# EAGLE design a78-simple-epi (EAGLE 7.0.0)
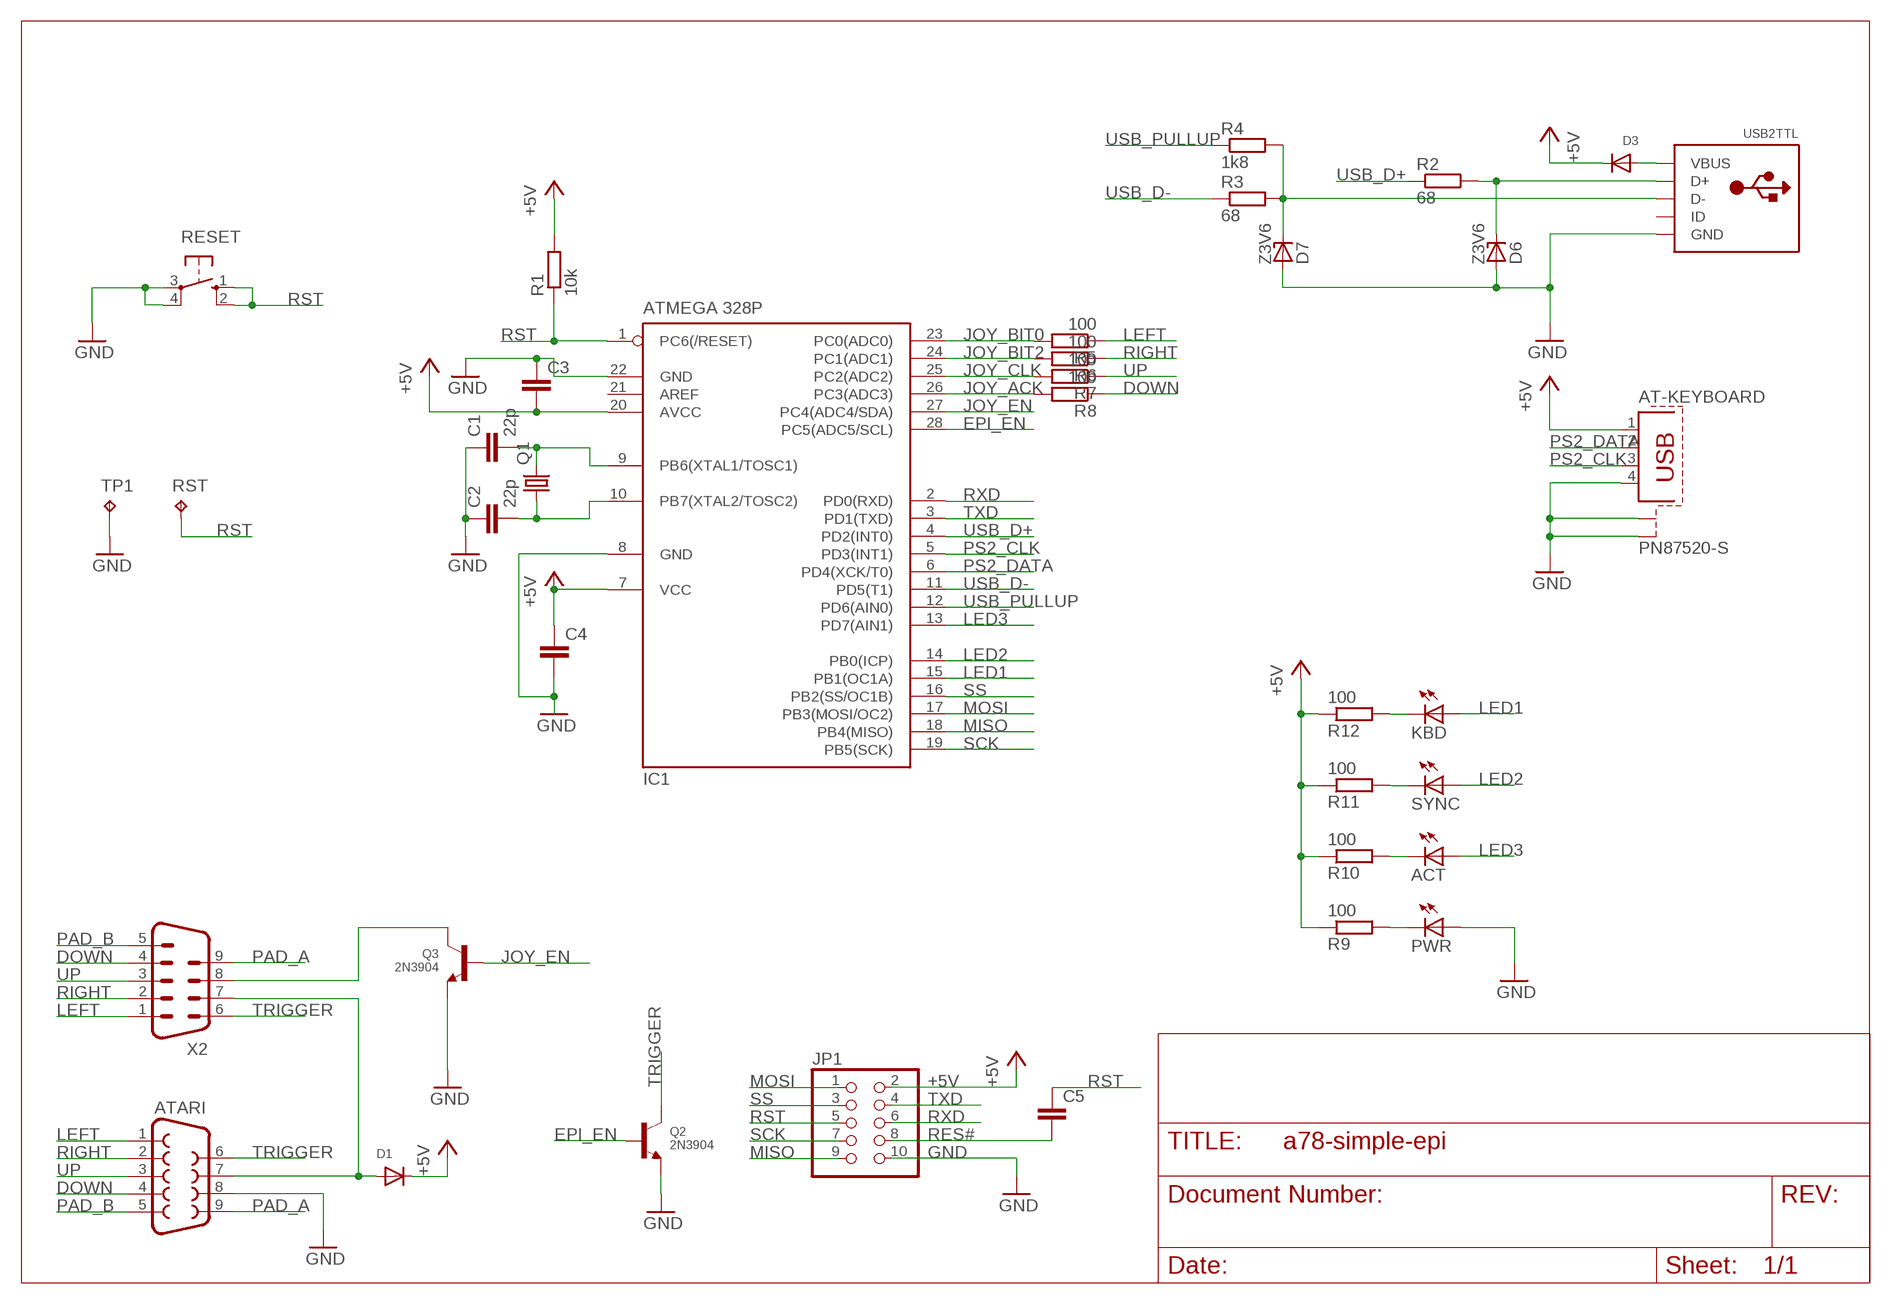
[diagram p0: schematic, sheet 1]

## Parts
ACT  LED3MM  [LED3MM]
AT-KEYBOARD  PN87520-S  [PN87520-S]
ATARI  F09D  [F09D]
C1  22p  C-EUC0603  [C0603]
C2  22p  C-EUC0603  [C0603]
C3  C-EUC0603  [C0603]
C4  C-EUC0603  [C0603]
C5  C-EUC0603  [C0603]
D1  DIODESOD-323F  [SOD-323F]
D3  DIODESOD-323F  [SOD-323F]
D6  Z3V6  ZENER-DIODESOT23  [SOT23]
D7  Z3V6  ZENER-DIODESOT23  [SOT23]
IC1  ATMEGA 328P  MEGA8-P  [DIL28-3]
JP1  PINHD-2X5  [2X05]
KBD  LED3MM  [LED3MM]
PWR  LED3MM  [LED3MM]
Q1  CRYSTALHC49S  [HC49S]
Q2  2N3904  TRANSISTOR_NPN  [SOT23-R]
Q3  2N3904  TRANSISTOR_NPN  [SOT23-R]
R1  10k  R-EU_R0603  [R0603]
R2  68  R-EU_R0603  [R0603]
R3  68  R-EU_R0603  [R0603]
R4  1k8  R-EU_R0603  [R0603]
R5  100  R-EU_R0603  [R0603]
R6  100  R-EU_R0603  [R0603]
R7  100  R-EU_R0603  [R0603]
R8  100  R-EU_R0603  [R0603]
R9  100  R-EU_R0603  [R0603]
R10  100  R-EU_R0603  [R0603]
R11  100  R-EU_R0603  [R0603]
R12  100  R-EU_R0603  [R0603]
RESET  10-XX  [B3F-10XX]
RST  TPB1,27  [B1,27]
SYNC  LED3MM  [LED3MM]
TP1  TPB1,27  [B1,27]
USB2TTL  USBMINIB  [USB-MINIB]
X2  M09D  [M09D]

## Nets
+5V: AT-KEYBOARD.1 C3.2 C4.1 D1.C D3.C IC1.7(VCC) IC1.20(AVCC) JP1.2 R1.2 R9.1 R10.1 R11.1 R12.1
DOWN: ATARI.4 R8.1 X2.4
EPI_EN: IC1.28(PC5(ADC5/SCL)) Q2.1(B)
GND: AT-KEYBOARD.4 AT-KEYBOARD.S1 AT-KEYBOARD.S2 ATARI.8 C1.1 C2.1 C3.1 C4.2 D6.1(A) D7.1(A) IC1.8(GND) IC1.22(GND) JP1.10 PWR.A Q2.2(E) Q3.2(E) RESET.3(P) RESET.4(P1) TP1.TP USB2TTL.GND
JOY_ACK: IC1.26(PC3(ADC3)) R8.2
JOY_BIT0: IC1.23(PC0(ADC0)) R5.2
JOY_BIT2: IC1.24(PC1(ADC1)) R6.2
JOY_CLK: IC1.25(PC2(ADC2)) R7.2
JOY_EN: IC1.27(PC4(ADC4/SDA)) Q3.1(B)
LED1: IC1.15(PB1(OC1A)) KBD.A
LED2: IC1.14(PB0(ICP)) SYNC.A
LED3: ACT.A IC1.13(PD7(AIN1))
LEFT: ATARI.1 R5.1 X2.1
MISO: IC1.18(PB4(MISO)) JP1.9
MOSI: IC1.17(PB3(MOSI/OC2)) JP1.1
N$1: Q3.3(C) X2.8
N$2: PWR.K(C) R9.2
N$3: ACT.K(C) R10.2
N$4: R11.2 SYNC.K(C)
N$5: KBD.K(C) R12.2
N$13: D7.3(C) R3.2 R4.2 USB2TTL.D-
N$14: D3.A USB2TTL.VBUS
N$15: D6.3(C) R2.2 USB2TTL.D+
N$17: ATARI.7 D1.A X2.7
N$19: C1.2 IC1.9(PB6(XTAL1/TOSC1)) Q1.2
N$20: C2.2 IC1.10(PB7(XTAL2/TOSC2)) Q1.1
PAD_A: ATARI.9 X2.9
PAD_B: ATARI.5 X2.5
PS2_CLK: AT-KEYBOARD.3 IC1.5(PD3(INT1))
PS2_DATA: AT-KEYBOARD.2 IC1.6(PD4(XCK/T0))
RES#: C5.2 JP1.8
RIGHT: ATARI.2 R6.1 X2.2
RST: C5.1 IC1.1(PC6(/RESET)) JP1.5 R1.1 RESET.1(S) RESET.2(S1) RST.TP
RXD: IC1.2(PD0(RXD)) JP1.6
SCK: IC1.19(PB5(SCK)) JP1.7
SS: IC1.16(PB2(SS/OC1B)) JP1.3
TRIGGER: ATARI.6 Q2.3(C) X2.6
TXD: IC1.3(PD1(TXD)) JP1.4
UP: ATARI.3 R7.1 X2.3
USB_D+: IC1.4(PD2(INT0)) R2.1
USB_D-: IC1.11(PD5(T1)) R3.1
USB_PULLUP: IC1.12(PD6(AIN0)) R4.1
Unconnected: IC1.21(AREF) USB2TTL.ID

## Library data of the parts
ACT KBD PWR SYNC = adafruit:LED: LED OSRAM: - CHIPLED LG R971, LG N971, LY N971, LG Q971, LY Q971, LO R971, LY R971 LH N974, LH R974 LS Q976, LO Q976, LY Q976 LO Q996 - Hyper CHIPLED LW Q18S LB Q993, LB Q99A, LB R99A - SideLED LS A670, LO A670, LY A670, LG A670, LP A670 LB A673, LV A673, LT A673, LW A673 LH A674 LY A675 LS A676, LA A676, LO A676, LY A676, LW A676 LS A679, LY A679, LG A679 - Hyper Micro SIDELED® LS Y876, LA Y876, LO Y876, LY Y876 LT Y87S - SmartLED LW L88C, LW L88S LB L89C, LB L89S, LG L890 LS L89K, LO L89K, LY L89K LS L896, LA L896, LO L896, LY L896 - TOPLED LS T670, LO T670, LY T670, LG T670, LP T670 LSG T670, LSP T670, LSY T670, LOP T670, LYG T670 LG T671, LOG T671, LSG T671 LB T673, LV T673, LT T673, LW T673 LH T674 LS T676, LA T676, LO T676, LY T676, LB T676, LH T676, LSB T676, LW T676 LB T67C, LV T67C, LT T67C, LS T67K, LO T67K, LY T67K, LW E67C LS E67B, LA E67B, LO E67B, LY E67B, LB E67C, LV E67C, LT E67C LW T67C LS T679, LY T679, LG T679 LS T770, LO T770, LY T770, LG T770, LP T770 LB T773, LV T773, LT T773, LW T773 LH T774 LS E675, LA E675, LY E675, LS T675 LS T776, LA T776, LO T776, LY T776, LB T776 LHGB T686 LT T68C, LB T68C - Hyper Mini TOPLED® LB M676 - Mini TOPLED Santana® LG M470 LS M47K, LO M47K, LY M47K Source: http://www.osram.convergy.de/
AT-KEYBOARD = con-berg:PN87520-S; OC_FARNELL: unknown; OC_NEWARK: unknown
ATARI = con-subd:F09: SUB-D; OC_FARNELL: unknown; OC_NEWARK: unknown
C1-C5 = resistor:C-EU: CAPACITOR, European symbol
D1 D3 = adafruit:DIODE: Diode SMADIODE - SMA Surface Mount Package 20V 1A Schottky Diode Digikey: 641-1014-6-ND DO-1N4148 - Through Hole Small Current Diode SOD-123 20V 1 A (.5mV Vf) Schottky Diode - Digikey: MBRX120TPMSCT-ND SOD-323 10V 570mA (.38mV Vf, 3ns) Schottky Diode - Digikey: ZLLS410CT-ND SOD-523 30V 30mA Schottky Diode (RB751S-40TE61) - Digikey: RB751S-40TE61CT-ND SOT23-R/W - SOT23 Package (R = Solder Paste/Reflow Ovens, W = Hand-Soldering) BAT54Film 40V 300mA - Digikey: 497-7162-1-ND
D6 D7 = diode:ZENER-DIODE: Z-Diode
IC1 = atmel:MEGA8-P: MICROCONTROLLER 8 Kbytes FLASH, 1 kbytes SRAM, 512 bytes EEPROM, USART, 4-channel 10 bit ADC, 2-channel 8 bit ADC Pin compatible with Atmega48, ATMega88, ATMega168 Source: avr.lbr; OC_FARNELL: unknown; OC_NEWARK: unknown
JP1 = pinhead:PINHD-2X5: PIN HEADER
Q1 = adafruit:CRYSTAL: CRYSTAL; OC_FARNELL: 1667008; OC_NEWARK: unknown
Q2 Q3 = microbuilder:TRANSISTOR_NPN: NPN Transistor Transistor (NPN) 500mA 45V - BC817 [Digikey: 568-1631-1-ND] Transistor (NPN) 500mA 45V - BC817,215 [Mouser: 771-BC817-T/R] SOT23-R - SOT23 footprint optimised for use with solder paste and reflow ovens. SOT23-W - SOT23 footprint optimised for hand-soldering (larger pads).
R1-R12 = resistor:R-EU_: RESISTOR, European symbol
RESET = switch-omron:10-XX: OMRON SWITCH; MPN: B3F-1000; OC_FARNELL: 176432; OC_NEWARK: 36M3542
RST TP1 = testpad:TP: Test pad
USB2TTL = adafruit:USB: USB Connectors USBMINIB - Surface Mount Female Mini-B USB Connector 4UConnector: 06564 By microbuilder.eu Thru-hole RA Female Mini-B USB Connector 4UConnector: 18732 By ladyada.net
X2 = con-subd:M09: SUB-D; OC_FARNELL: unknown; OC_NEWARK: unknown

## Board
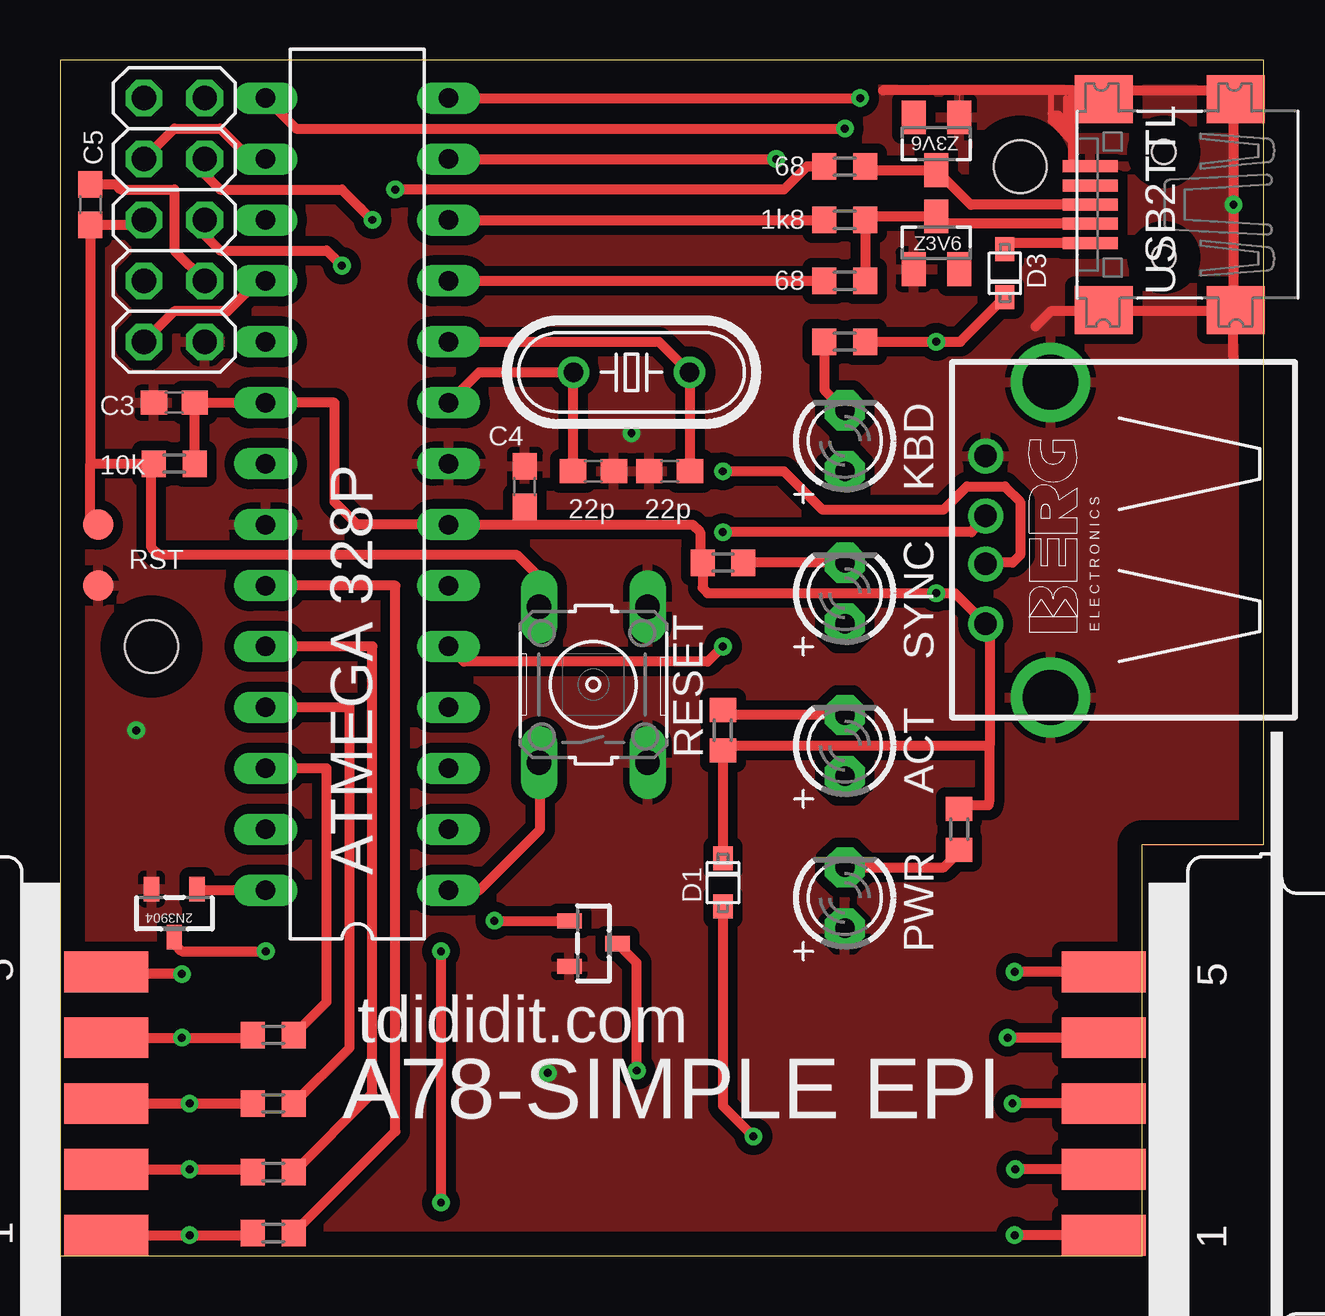
[diagram p1: board, top side]
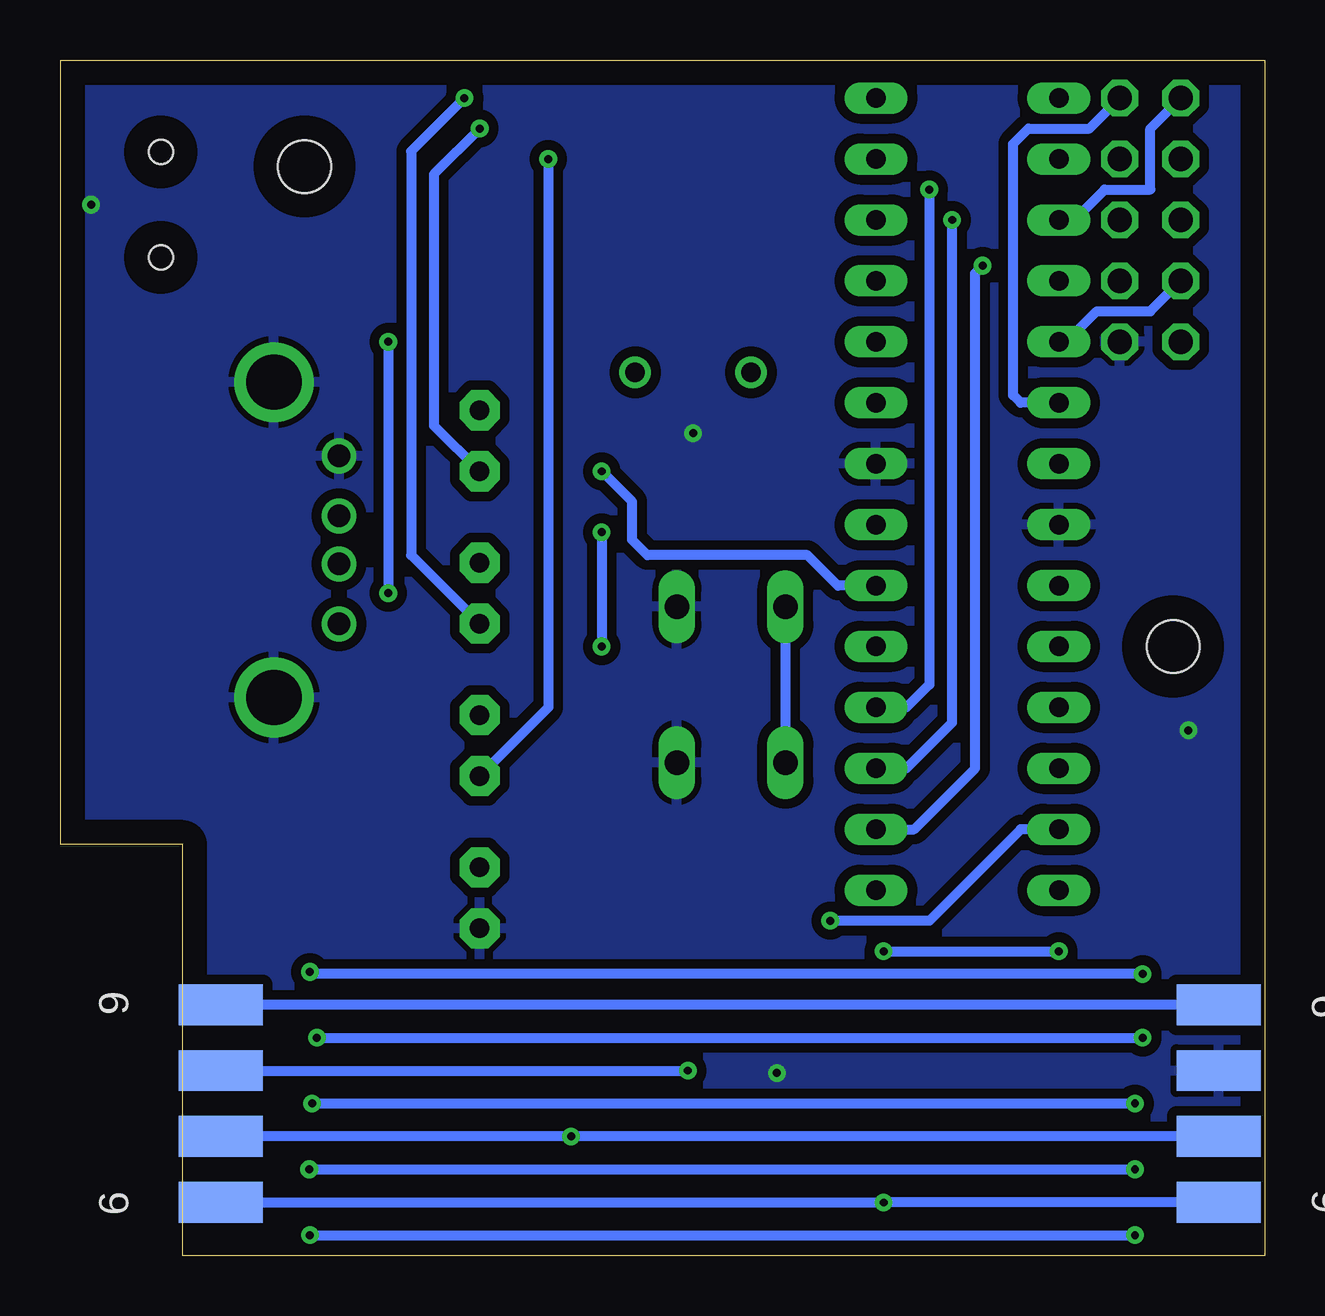
[diagram p2: board, bottom side, seen from below]

Size 50.16 x 49.85 mm. Coordinates in mm from the lower left corner, seen from the top.
Outline: 0,49.85 0,0 45.09,0 45.09,17.15 50.16,17.15 50.16,49.85 0,49.85
Copper layers (1*16): Top 0.035mm / dielectric 1.5mm / Bottom 0.035mm
Design rules "default": minimum track width 10mil, minimum drill 24mil, track to track 8mil, track to pad 8mil, pad to pad 8mil, via to via 8mil, smd to smd 8mil, copper to edge 40mil, drill to drill 8mil, minimum pad ring 10mil, minimum via ring 8mil, stop-mask expansion 4mil, vias tented up to drill 0mil, thermal gap 10mil
Holes 2.2 mm at 40.01,45.4 3.81,25.4

### Footprints (pad centres in the part's own frame; a part is rotated, then mirrored left to right if it is on the bottom)
LED3MM = drill 0.813 pad 1.676 octagon: A -1.27,0; K 1.27,0
PN87520-S = drill 0.95: 1 -3.5,2.71; 2 -1,2.71; 3 1,2.71; 4 3.5,2.71 | drill 2.3 pad 2.9: S1 -6.57,0; S2 6.57,0
F09D = smd 1.7 x 3.5: 1 -5.486,-6.045; 2 -2.743,-6.045; 3 0,-6.045; 4 2.743,-6.045; 5 5.486,-6.045 | smd 1.7 x 3.5 bottom: 6 -4.115,-6.045; 7 -1.372,-6.045; 8 1.372,-6.045; 9 4.115,-6.045
C0603 = smd 1.1 x 1: 1 -0.85,0; 2 0.85,0
SOD-323F = smd 1 x 0.8: A -1,0; C 1,0
SOT23 = smd 1 x 1.4: 1 -0.95,-1.1; 2 0.95,-1.1; 3 0,1.1
DIL28-3 = drill 0.813 long: 1 -16.51,-3.81; 2 -13.97,-3.81; 3 -11.43,-3.81; 4 -8.89,-3.81; 5 -6.35,-3.81; 6 -3.81,-3.81; 7 -1.27,-3.81; 8 1.27,-3.81; 9 3.81,-3.81; 10 6.35,-3.81; 11 8.89,-3.81; 12 11.43,-3.81; 13 13.97,-3.81; 14 16.51,-3.81; 15 16.51,3.81; 16 13.97,3.81; 17 11.43,3.81; 18 8.89,3.81; 19 6.35,3.81; 20 3.81,3.81; 21 1.27,3.81; 22 -1.27,3.81; 23 -3.81,3.81; 24 -6.35,3.81; 25 -8.89,3.81; 26 -11.43,3.81; 27 -13.97,3.81; 28 -16.51,3.81
2X05 = drill 1.016 octagon: 1 -5.08,-1.27; 2 -5.08,1.27; 3 -2.54,-1.27; 4 -2.54,1.27; 5 0,-1.27; 6 0,1.27; 7 2.54,-1.27; 8 2.54,1.27; 9 5.08,-1.27; 10 5.08,1.27
HC49S = drill 0.813: 1 -2.413,0; 2 2.413,0
SOT23-R = smd 0.635 x 1.016: 1 -0.95,-1; 2 0.95,-1; 3 0,1
R0603 = smd 1 x 1.1: 1 -0.85,0; 2 0.85,0
B3F-10XX = drill 1.016 long: 1 -3.251,2.261; 2 3.251,2.261; 3 -3.251,-2.261; 4 3.251,-2.261
B1,27 = smd 1.27 x 1.27: TP 0,0
USB-MINIB = smd 0.5 x 2.308: D+ 0,4.064; D- -0.8,4.064; GND 1.6,4.064; ID 0.8,4.064; VBUS -1.6,4.064 | smd 2 x 2.4: GND1 -4.4,-2; GND2 -4.4,3.5; GND3 4.4,3.5; GND4 4.4,-2 | hole 1: -2.2,1; 2.2,1
M09D = smd 1.7 x 3.5: 1 5.486,-6.045; 2 2.743,-6.045; 3 0,-6.045; 4 -2.743,-6.045; 5 -5.486,-6.045 | smd 1.7 x 3.5 bottom: 6 4.115,-6.045; 7 1.372,-6.045; 8 -1.372,-6.045; 9 -4.115,-6.045

### Placement (x,y rotation side)
ACT  32.7,21.27 90 top
AT-KEYBOARD  41.27,29.84 90 top
ATARI  -4.13,6.35 90 top
C1  22.23,32.7 180 top
C2  25.4,32.7 0 top
C3  4.76,35.56 0 top
C4  19.37,32.07 90 top
C5  1.27,43.81 90 top
D1  27.62,15.56 90 top
D3  39.37,40.96 270 top
D6  36.51,46.35 180 top
D7  36.51,42.23 0 top
IC1  12.38,31.75 90 top
JP1  4.76,43.18 270 top
KBD  32.7,33.97 90 top
PWR  32.7,14.92 90 top
Q1  23.81,36.83 180 top
Q2  4.76,14.29 180 top
Q3  22.23,13.02 270 top
R1  4.76,33.02 0 top
R2  32.7,45.4 0 top
R3  32.7,40.64 0 top
R4  32.7,43.18 0 top
R5  8.89,0.95 0 top
R6  8.89,3.49 0 top
R7  8.89,6.35 0 top
R8  8.89,9.21 0 top
R9  37.47,17.78 270 top
R10  27.62,21.91 90 top
R11  27.62,28.89 0 top
R12  32.7,38.1 180 top
RESET  22.23,23.81 90 top
RST  1.59,30.48 0 top
SYNC  32.7,27.62 90 top
TP1  1.59,27.94 0 top
USB2TTL  46.99,43.81 90 top
X2  49.53,6.35 270 top

### Tracks (layer width: path | path; a pad name or v marks a point on that pad's centre or on a via)
+5V  (via drill 0.33)
  Top 0.406: R1.2 C3.2 IC1.20 11.43,35.56 11.43,31.43 12.38,30.48 IC1.7 19.27,30.48 | 19.27,30.48 C4.1 | R12.1 v36.51,38.1 37.51,38.1 D3.C | 19.27,30.48 26.35,30.48 26.67,30.16 26.67,28.99 R11.1 26.77,27.84 26.99,27.62 v36.51,27.62 37.15,27.62 37.29,27.62 AT-KEYBOARD.1 38.73,26.17 38.73,21.27 | 38.73,21.27 27.62,21.27 28.04,21.17 R10.1 D1.C | 38.73,21.27 38.73,19.05 38.69,18.78 37.62,18.78 R9.1
  Bottom 0.406: IC1.20 10.16,35.56 10.48,35.88 10.48,46.35 9.84,46.99 7.3,46.99 JP1.2 | v36.51,38.1 v36.51,27.62
DOWN  (via drill 0.33)
  Top 0.406: ATARI.4 v5.08,9.09 7.93,9.09 R8.1 | X2.4 v39.48,9.09
  Bottom 0.406: v39.48,9.09 v5.08,9.09
EPI_EN
  Top 0.406: IC1.28 5.76,15.24 Q2.1
GND  (via drill 0.33)
  Top 0: 37.47,48.58 D6.1
  Top 0.24: 41.27,48.58 41.27,47.62 | 41.27,47.62 41.27,47.31 42.23,46.35 42.23,46.67 41.27,47.62 | 41.91,48.26 41.91,47.31 | 41.91,47.31 41.91,46.99 | 41.27,47.62 41.59,47.62 41.91,47.31
  Top 0.406: USB2TTL.GND 42.22,45.41 42.23,45.4 42.23,46.35 42.23,48.58 | 42.23,48.58 48.9,48.58 48.9,39.37 | 48.9,37.46 48.9,39.37 | 48.9,39.37 41.27,39.37 40.64,38.73 | 42.23,48.58 41.27,48.58 37.47,48.58 34.29,48.58
  other vias: 3.17,21.91 20.32,7.62 23.81,34.29 48.9,43.81
  pour Top (isolate 0.406): 0,50.16 50.16,50.16 50.16,-0.95 0,-0.95
  pour Bottom (isolate 0.406): 0,50.16 50.16,50.16 50.16,-0.95 0,-0.95
JOY_ACK
  Top 0.406: R8.2 11.11,10.58 11.11,20.32 IC1.26
JOY_BIT0
  Top 0.406: R5.2 13.97,5.18 13.97,27.94 IC1.23
JOY_BIT2
  Top 0.406: R6.2 13.02,6.77 13.02,25.4 IC1.24
JOY_CLK
  Top 0.406: R7.2 12.06,8.67 12.06,22.86 IC1.25
JOY_EN  (via drill 0.33)
  Top 0.406: v18.1,13.97 20.95,13.97 21.27,14.02 Q3.1
  Bottom 0.406: IC1.27 10.16,17.78 13.97,13.97 v18.1,13.97
LED1  (via drill 0.33)
  Top 0.406: IC1.15 9.84,46.99 v32.7,46.99
  Bottom 0.406: v32.7,46.99 34.61,45.09 34.61,34.61 KBD.A
LED2  (via drill 0.33)
  Top 0.406: IC1.14 v33.34,48.26
  Bottom 0.406: v33.34,48.26 35.56,46.04 35.56,29.21 SYNC.A
LED3  (via drill 0.33)
  Top 0.406: IC1.13 v29.84,45.72
  Bottom 0.406: v29.84,45.72 29.84,22.86 ACT.A
LEFT  (via drill 0.33)
  Top 0.406: ATARI.1 v5.4,0.86 7.95,0.86 R5.1 | X2.1 v39.78,0.86
  Bottom 0.406: v39.78,0.86 v5.4,0.86
MISO
  Top 0.406: IC1.18 8.26,40.64 6.99,39.37 4.76,39.37 JP1.9
MOSI
  Bottom 0.406: IC1.17 7.94,43.18 6.67,44.45 4.76,44.45 4.76,46.99 JP1.1
N$1  (via drill 0.33)
  Top 0.406: v24.03,7.72 24.03,12.21 Q3.3
  Bottom 0.406: X2.8 v24.03,7.72
N$2
  Top 0.406: PWR.K 36.83,16.19 37.47,16.83 R9.2
N$3
  Top 0.406: ACT.K 27.84,22.54 R10.2
N$4
  Top 0.406: SYNC.K R11.2
N$5
  Top 0.406: R12.2 31.85,36.09 KBD.K
N$13
  Top 0.406: R3.2 R4.2 33.7,43.33 D7.3 36.83,43.02 USB2TTL.D-
N$14
  Top 0.406: USB2TTL.VBUS 39.63,42.21 arc90 D3.A
N$15
  Top 0.406: R2.2 33.7,45.25 D6.3 37.95,43.81 USB2TTL.D+
N$17  (via drill 0.33)
  Top 0.406: D1.A 27.62,6.25 v28.89,4.98
  Bottom 0.406: ATARI.7 v28.89,4.98 X2.7
N$19
  Top 0.406: IC1.9 17.46,36.83 Q1.2 21.38,36.8 C1.2
N$20
  Top 0.406: IC1.10 24.96,38.1 Q1.1 26.25,36.8 C2.2
PAD_A
  Bottom 0.406: ATARI.9 X2.9
PAD_B  (via drill 0.33)
  Top 0.406: X2.5 v39.78,11.84 | v5.08,11.75 2.01,11.75 ATARI.5
  Bottom 0.406: v5.08,11.75 39.69,11.75 v39.78,11.84
PS2_CLK  (via drill 0.33)
  Top 0.406: AT-KEYBOARD.3 37.98,30.16 v27.62,30.16 | v27.62,25.4 26.99,24.77 16.83,24.77 IC1.5
  Bottom 0.406: v27.62,30.16 v27.62,25.4
PS2_DATA  (via drill 0.33)
  Top 0.406: v27.62,32.7 30.16,32.7 31.75,31.11 36.83,31.11 37.78,32.07 39.37,32.07 40.01,31.43 40.01,29.21 39.69,28.89 38.61,28.89 AT-KEYBOARD.2
  Bottom 0.406: IC1.6 17.78,27.94 19.05,29.21 25.72,29.21 26.35,29.84 26.35,31.43 v27.62,32.7
RES#
  Top 0.406: C5.2 2.33,44.66 2.54,44.45 4.76,44.45 4.76,41.91 JP1.8
RIGHT  (via drill 0.33)
  Top 0.406: ATARI.2 v5.4,3.61 7.93,3.61 R6.1 | X2.2 v39.8,3.61
  Bottom 0.406: v39.8,3.61 v5.4,3.61
RST
  Top 0.406: IC1.1 17.46,15.24 20,17.78 20,20.52 RESET.1 | RESET.2 19.96,28.3 19.05,29.21 4.13,29.21 3.81,29.53 3.81,33.02 R1.1 1.27,33.02 | C5.1 1.37,42.96 | JP1.5 3.28,42.96 1.37,42.96 | 1.37,42.96 1.27,42.86 1.27,33.02 | RST.TP 1.27,30.8 1.27,33.02
  Bottom 0.406: RESET.2 RESET.1
RXD  (via drill 0.33)
  Top 0.406: JP1.6 6.03,42.55 6.67,41.91 11.11,41.91 11.43,41.59 v11.75,41.27
  Bottom 0.406: IC1.2 14.61,17.78 12.06,20.32 12.06,40.96 v11.75,41.27
SCK
  Bottom 0.406: IC1.19 8.26,38.1 6.99,39.37 4.76,39.37 JP1.7
SS
  Top 0.406: JP1.3 4.76,46.99 6.67,46.99 7.94,45.72 IC1.16
TRIGGER  (via drill 0.33)
  Top 0.406: Q2.3 4.76,13.02 5.08,12.7 v8.57,12.7 | v15.88,2.22 v15.88,12.7
  Bottom 0.406: ATARI.6 15.86,2.23 v15.88,2.22 v15.89,2.23 X2.6 | v15.88,12.7 v8.57,12.7
TXD  (via drill 0.33)
  Top 0.406: JP1.4 6.03,45.09 6.67,44.45 11.75,44.45 12.54,43.66 v13.02,43.18
  Bottom 0.406: IC1.3 14.92,20.32 13.02,22.23 v13.02,43.18
UP  (via drill 0.33)
  Top 0.406: ATARI.3 v5.4,6.35 R7.1 | X2.3 v39.69,6.35
  Bottom 0.406: v39.69,6.35 v5.4,6.35
USB_D+  (via drill 0.33)
  Top 0.406: R2.1 31.11,45.4 30.16,44.45 v13.97,44.45
  Bottom 0.406: v13.97,44.45 13.97,23.81 14.92,22.86 IC1.4
USB_D-
  Top 0.406: IC1.11 R3.1
USB_PULLUP
  Top 0.406: IC1.12 R4.1

### Text on the board
tNames: tdididit.com | A78-SIMPLE EPI